# Altium project Relay Controller REV1.PrjPcb
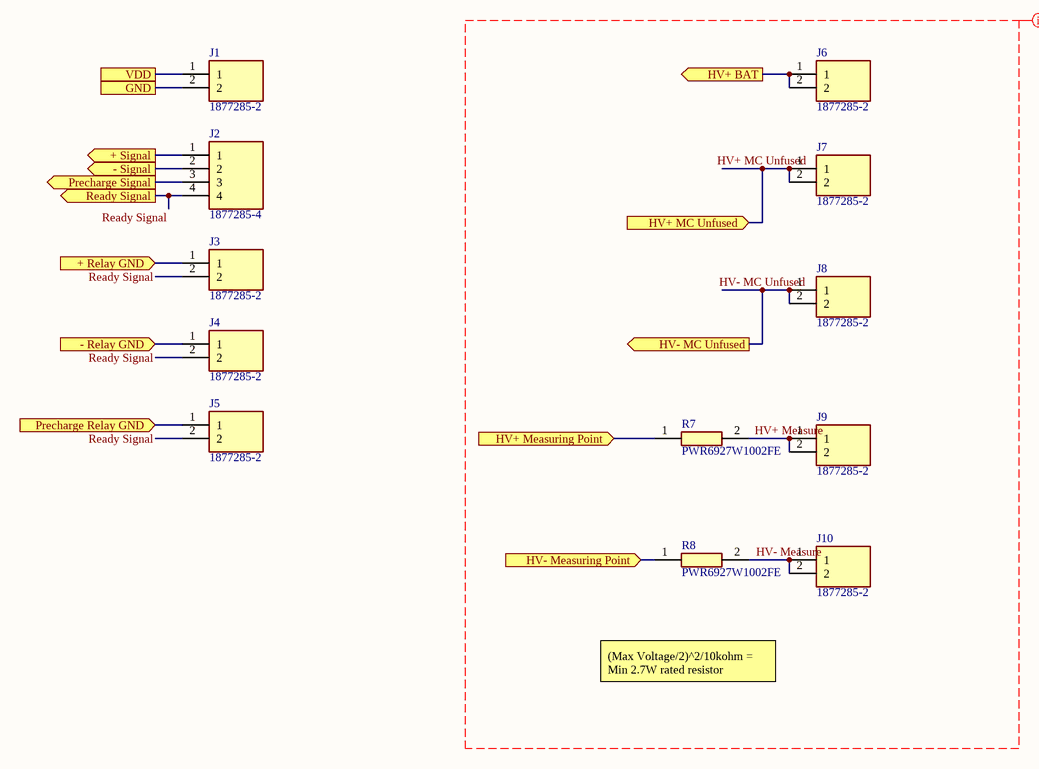
[diagram p0: Connectors.SchDoc]
2 sheets, 12 parts. Net scope: hierarchical (ports join the sheet entries above them; power ports are global).
Board file: Relay Controller REV1.PcbDoc
Sheets:
  Connectors.SchDoc
  LEDs.SchDoc

## Sheet Connectors.SchDoc
size A; SheetNumber: 3; SheetTotal: 5

### Parts
J1  1877285-2  [18772852]
J2  1877285-4  [18772854]
J3  1877285-2  [18772852]
J4  1877285-2  [18772852]
J5  1877285-2  [18772852]
J6  1877285-2  [18772852]
J7  1877285-2  [18772852]
J8  1877285-2  [18772852]
J9  1877285-2  [18772852]
J10  1877285-2  [18772852]
R7  PWR6927W1002FE  [RESM17569X685N]
R8  PWR6927W1002FE  [RESM17569X685N]

### Ports
+ Relay GND (in), + Signal (out), - Relay GND (in), - Signal (out), GND, HV+ BAT (out), HV+ MC Unfused (in), HV+ Measuring Point (in), HV- MC Unfused (out), HV- Measuring Point (in), Precharge Relay GND (in), Precharge Signal (out), Ready Signal (out), VDD

### Nets
HV+ MC Unfused: J7.1 J7.2 ; port HV+ MC Unfused
HV+ Measure: J9.1 J9.2 R7.2
HV- MC Unfused: J8.1 J8.2 ; port HV- MC Unfused
HV- Measure: J10.1 J10.2 R8.2
Ready Signal: J2.4 J3.2 J4.2 J5.2 ; port Ready Signal
NetJ1_1: J1.1 ; port VDD
NetJ1_2: J1.2 ; port GND
NetJ2_1: J2.1 ; port + Signal
NetJ2_2: J2.2 ; port - Signal
NetJ2_3: J2.3 ; port Precharge Signal
NetJ3_1: J3.1 ; port + Relay GND
NetJ4_1: J4.1 ; port - Relay GND
NetJ5_1: J5.1 ; port Precharge Relay GND
NetJ6_1: J6.1 J6.2 ; port HV+ BAT
NetR7_1: R7.1 ; port HV+ Measuring Point
NetR8_1: R8.1 ; port HV- Measuring Point

### Layout directives
mark named HIGH VOLTAGE: HV+ MC Unfused, HV+ Measure, HV- MC Unfused, HV- Measure

### Notes on the sheet
- (Max Voltage/2)^2/10kohm = Min 2.7W rated resistor

### Library data of the parts
J1 J3-J10 = 1877285-2: Connector; Manufacturer_Name: TE Connectivity; Datasheet Link: https://www.te.com/commerce/DocumentDelivery/DDEController?Action=srchrtrv&DocNm=7-1773458-5_ECONOMY_POWER_QRG&DocType=Data%20Sheet&DocLang=English&PartCntxt=1877285-2&DocFormat=pdf; Height: 12mm; Manufacturer_Part_Number: 1877285-2; Mouser Part Number: 571-1877285-2; Mouser Price/Stock: https://www.mouser.co.uk/ProductDetail/TE-Connectivity/1877285-2?qs=ka3zfMQDmFlAIZq5pDt5JA%3D%3D; Arrow Part Number: 1877285-2; Arrow Price/Stock: https://www.arrow.com/en/products/1877285-2/te-connectivity?region=europe
J2 = 1877285-4: Connector; Manufacturer_Name: TE Connectivity; Datasheet Link: https://www.te.com/commerce/DocumentDelivery/DDEController?Action=srchrtrv&DocNm=1877285&DocType=Customer%20Drawing&DocLang=English&PartCntxt=1877285-4&DocFormat=pdf; Height: 12.5mm; Manufacturer_Part_Number: 1877285-4; Mouser Part Number: 571-1877285-4; Mouser Price/Stock: https://www.mouser.co.uk/ProductDetail/TE-Connectivity/1877285-4?qs=ka3zfMQDmFkZPBtotDIXvQ%3D%3D; Arrow Part Number: 1877285-4; Arrow Price/Stock: https://www.arrow.com/en/products/1877285-4/te-connectivity?region=nac
R7 R8 = PWR6927W1002FE: Resistor; Manufacturer_Name: Bourns; Datasheet Link: https://www.bourns.com/docs/Product-Datasheets/PWR6927_8030_8937_A247_B053.pdf; Height: 6.85mm; Manufacturer_Part_Number: PWR6927W1002FE; Mouser Part Number: 652-PWR6927W1002FE; Mouser Price/Stock: https://www.mouser.co.uk/ProductDetail/Bourns/PWR6927W1002FE?qs=NeOn4crkEusWUfkTem4h9g%3D%3D

## Sheet LEDs.SchDoc
size A; SheetNumber: 4; SheetTotal: 5
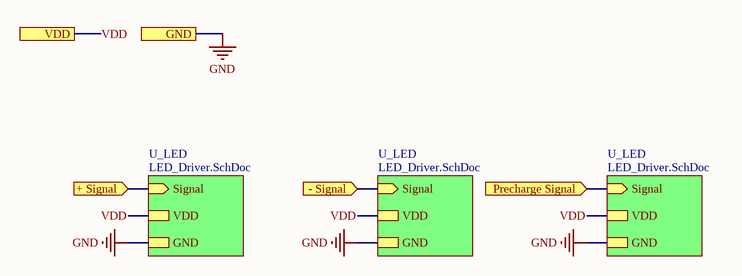
[diagram p1: LEDs.SchDoc]

### Sub-sheets
U_LED = LED_Driver.SchDoc (file not in this document): Signal (in), VDD, GND
U_LED = LED_Driver.SchDoc (file not in this document): Signal (in), VDD, GND
U_LED = LED_Driver.SchDoc (file not in this document): Signal (in), VDD, GND

### Ports
+ Signal (in), - Signal (in), GND, Precharge Signal (in), VDD

### Nets
GND: port GND, sheet U_LED/GND, sheet U_LED/GND, sheet U_LED/GND
VDD: port VDD, sheet U_LED/VDD, sheet U_LED/VDD, sheet U_LED/VDD
(unnamed): port + Signal, sheet U_LED/Signal
(unnamed): port - Signal, sheet U_LED/Signal
(unnamed): port Precharge Signal, sheet U_LED/Signal